# Altium schematic sheet digipot.SchDoc
size A
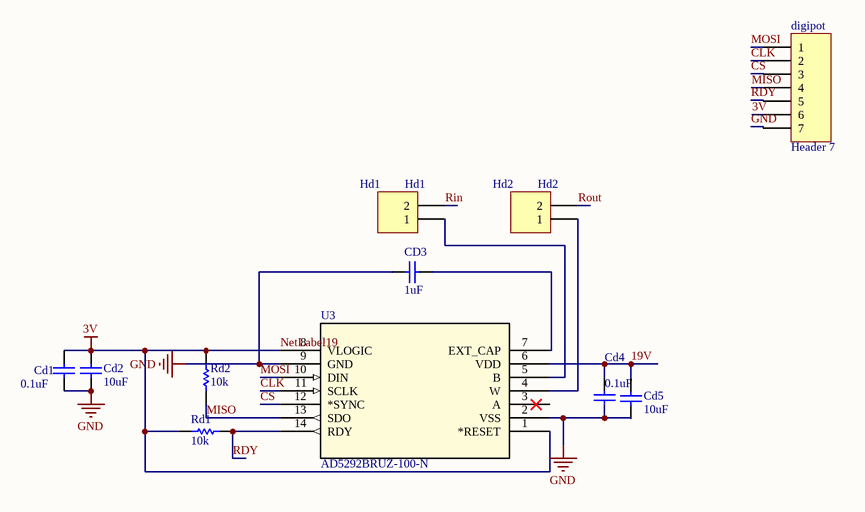
[diagram p0: digipot.SchDoc]

## Parts
Cd1  value 0.1uF  [CC2012-0805]  (hidden comment: Cap-NP)
Cd2  value 10uF  [CC2012-0805]  (hidden comment: Cap-NP)
CD3  value 1uF  [CC2012-0805]  (hidden comment: Cap-NP)
Cd4  value 0.1uF  [CC2012-0805]  (hidden comment: Cap-NP)
Cd5  value 10uF  [CC2012-0805]  (hidden comment: Cap-NP)
digipot  Header 7  [HDR1X7]
Hd1  Hd1  [HDR1X2]
Hd2  Hd2  [HDR1X2]
Rd1  value 10k  [CC2012-0805]  (hidden comment: Res)
Rd2  value 10k  [CC2012-0805]  (hidden comment: Res)
U3  AD5292BRUZ-100-N  [RU_14]

## Nets
3V: Cd1.1 Cd2.1 digipot.6 Rd1.2 Rd2.1 U3.1(*RESET) U3.8(VLOGIC)  [also labelled NetLabel19]
GND: Cd1.2 Cd2.2 CD3.1 Cd4.1 Cd5.1 digipot.7 U3.2(VSS) U3.9(GND)
19V: Cd4.2 Cd5.2 U3.6(VDD)
CLK: digipot.2 U3.11(SCLK)
CS: digipot.3 U3.12(*SYNC)
MISO: digipot.4 Rd2.2 U3.13(SDO)
MOSI: digipot.1 U3.10(DIN)
RDY: digipot.5 Rd1.1 U3.14(RDY)
Rin: Hd1.2
Rout: Hd2.2
NetCD3_2: CD3.2 U3.7(EXT_CAP)
NetHd1_1: Hd1.1 U3.5(B)
NetHd2_1: Hd2.1 U3.4(W)

Not connected (* = marked no-connect by the designer): U3 3(A)

## Library data of the parts
Cd1 Cd2 CD3 Cd4 Cd5 = Cap-NP: Capacitor; Manufacturer: Generic Components; Class I: Passive; Published: 8-Jun-2000; Revision: July-2002: Re-released for DXP Platform.; Publisher: Altium Limited; Class II: Capacitor
digipot = Header 7: Header, 7-Pin; LatestRevisionDate: 17-Jul-2002; LatestRevisionNote: Re-released for DXP Platform.; Publisher: Altium Limited
Hd1 Hd2 = Header 2: Header, 2-Pin; LatestRevisionDate: 17-Jul-2002; LatestRevisionNote: Re-released for DXP Platform.; Publisher: Altium Limited
Rd1 Rd2 = Res: Resistor; Manufacturer: Generic Components; Class I: Passive; Published: 8-Jun-2000; Revision: July-2002: Re-released for DXP Platform.; Publisher: Altium Limited; Class II: Resistor
U3 = AD5292BRUZ-100-N: Imported; Manufacturer_Part_Number: AD5292BRUZ-100-ND; Vendor: Analog Devices Inc; Built_By: EMA_UL_Team; RefDes: RefDes; Type: DEV; Value: Value